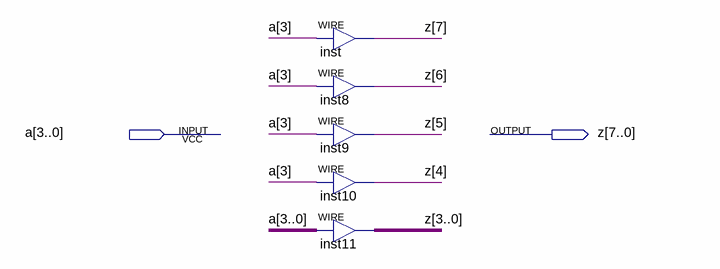
[diagram p0: schematic sheet]
// Quartus schematic CA2_4A8.bdf as structural Verilog: 5 symbols, 2 pins
module CA2_4A8 (
  input  [3:0] a,
  output [7:0] z
);

  assign z[7] = a[3];  // WIRE inst
  assign z[6] = a[3];  // WIRE inst8
  assign z[5] = a[3];  // WIRE inst9
  assign z[4] = a[3];  // WIRE inst10
  assign z[3:0] = a;  // WIRE inst11
endmodule
